# Altium schematic sheet eps_bt.SchDoc: Boost
size A; DrawnBy: J. Reimer T. Yeung M. Au; Organization: UTAT SS; DocumentNumber: 3; Revision: 2.0; SheetNumber: 3; SheetTotal: 17
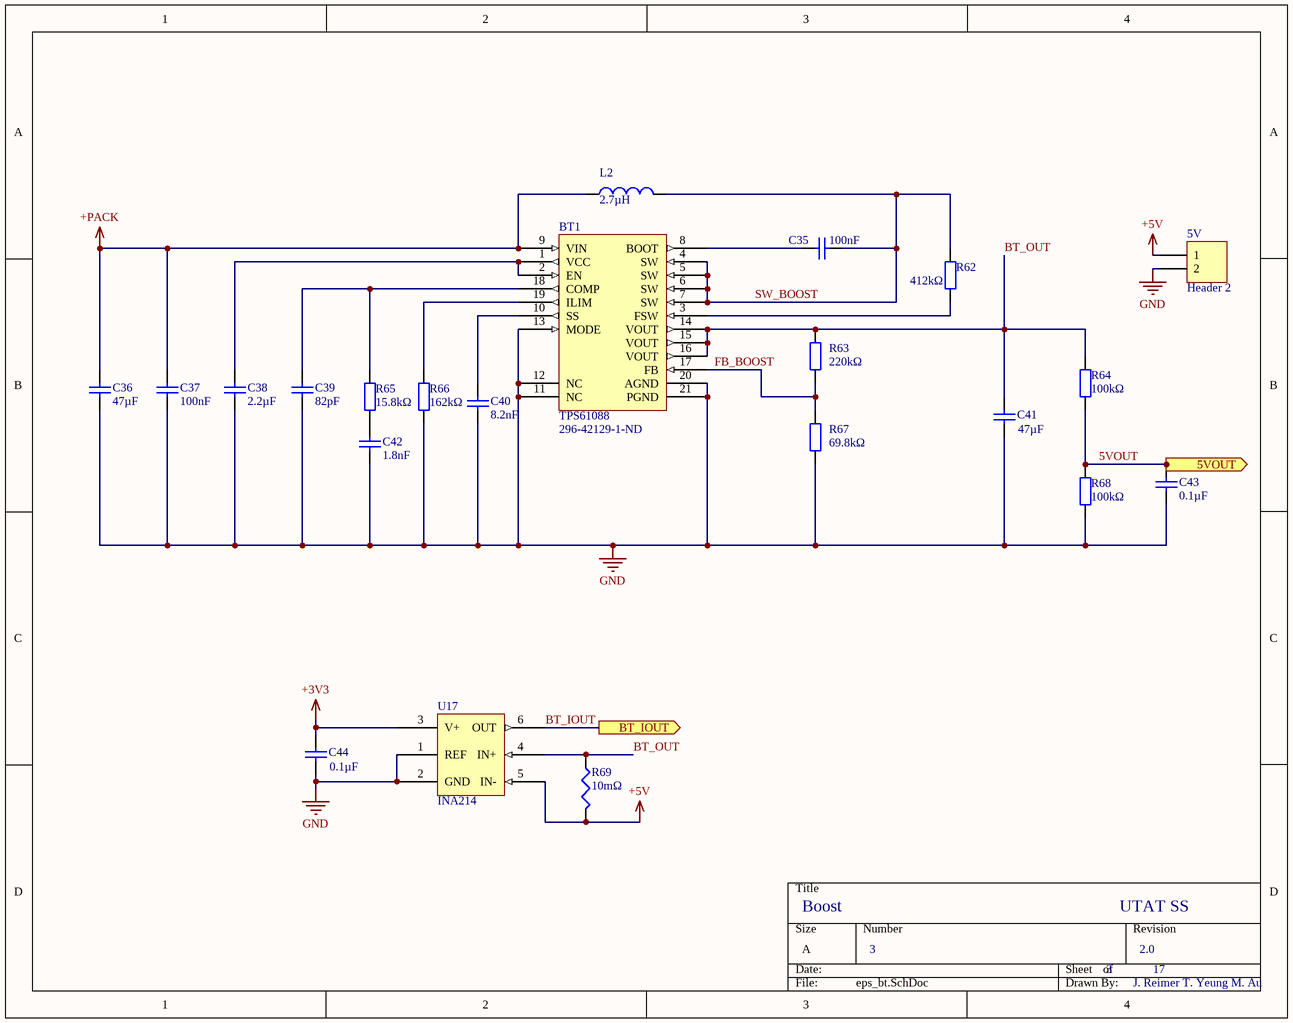
[diagram p0: eps_bt.SchDoc]

## Parts
5V  Header 2  [CON2_SCREW_5.00MM_691102710002]
BT1  TPS61088  Supplier Part Number 1: 296-42129-1-ND  [QFN50P450X350X100-21N]
C35  100nF  [1608[0603]]
C36  47µF  [C0805]
C37  100nF  [C0805]
C38  2.2µF  [1608[0603]]
C39  82pF  [1608[0603]]
C40  8.2nF  [1608[0603]]
C41  47µF  [C0805]
C42  1.8nF  [1608[0603]]
C43  0.1µF  [1608[0603]]
C44  0.1µF  [1608[0603]]
L2  2.7µH  [74439358022]
R62  412kΩ  [1608[0603]]
R63  220kΩ  [1608[0603]]
R64  100kΩ  [1608[0603]]
R65  15.8kΩ  [1608[0603]]
R66  162kΩ  [1608[0603]]
R67  69.8kΩ  [1608[0603]]
R68  100kΩ  [1608[0603]]
R69  10mΩ  [C1206]
U17  INA214  [SOT65P210X110-6N]

## Ports
5VOUT (out), BT_IOUT (out)

## Nets
+3V3: C44.1 U17.3(V+)
+5V: 5V.1 R69.2 U17.5(IN-)
+PACK: BT1.9(VIN) C36.2 C37.2 L2.1
GND: 5V.2 BT1.11(NC) BT1.12(NC) BT1.13(MODE) BT1.20(AGND) BT1.21(PGND) C36.1 C37.1 C38.1 C39.1 C40.1 C41.1 C42.1 C43.2 C44.2 R66.1 R67.1 R68.1 U17.1(REF) U17.2(GND)
5VOUT: C43.1 R64.1 R68.2 ; port 5VOUT
BT_IOUT: U17.6(OUT) ; port BT_IOUT
BT_OUT: BT1.14(VOUT) BT1.15(VOUT) BT1.16(VOUT) C41.2 R63.2 R64.2 R69.1 U17.4(IN+)
FB_BOOST: BT1.17(FB) R63.1 R67.2
SW_BOOST: BT1.4(SW) BT1.5(SW) BT1.6(SW) BT1.7(SW) C35.1 L2.2 R62.1
NetBT1_1: BT1.1(VCC) BT1.2(EN) C38.2
NetBT1_3: BT1.3(FSW) R62.2
NetBT1_8: BT1.8(BOOT) C35.2
NetBT1_10: BT1.10(SS) C40.2
NetBT1_18: BT1.18(COMP) C39.2 R65.2
NetBT1_19: BT1.19(ILIM) R66.2
NetC42_2: C42.2 R65.1

## Library data of the parts
5V = Header 2: Battery Header, 2-Pin; LatestRevisionDate: 17-Jul-2002; LatestRevisionNote: Re-released for DXP Platform.; Publisher: Altium Limited; Supplier 1: Digi-Key; Supplier Part Number 1: WM1351-ND
BT1 = TPS61088: Boost converter; Supplier 1: Digi-Key
C35 = Cap: Capacitor, Cbst; Published: 8-Jun-2000; LatestRevisionDate: 17-Jul-2002; LatestRevisionNote: Re-released for DXP Platform.; PackageReference: RAD-0.3; Publisher: Altium Limited; PackageDescription: Radial Cap, Thru-Hole; 2 Leads; 0.3 in Pin Spacing; Value: 100nF; Supplier 1: Digi-Key; Supplier Part Number 1: 311-1344-6-ND
C36 = Cap: Capacitor, Cinbt1; Published: 8-Jun-2000; LatestRevisionDate: 17-Jul-2002; LatestRevisionNote: Re-released for DXP Platform.; PackageReference: RAD-0.3; Publisher: Altium Limited; PackageDescription: Radial Cap, Thru-Hole; 2 Leads; 0.3 in Pin Spacing; Value: 47µF; Supplier 1: Digi-Key; Supplier Part Number 1: 490-9960-6-ND
C37 = Cap: Capacitor, Cinbt2; Published: 8-Jun-2000; LatestRevisionDate: 17-Jul-2002; LatestRevisionNote: Re-released for DXP Platform.; PackageReference: RAD-0.3; Publisher: Altium Limited; PackageDescription: Radial Cap, Thru-Hole; 2 Leads; 0.3 in Pin Spacing; Value: 100nF; Supplier 1: Digi-Key; Supplier Part Number 1: 311-1141-6-ND
C38 = Cap: Capacitor, Cvcc1; Published: 8-Jun-2000; LatestRevisionDate: 17-Jul-2002; LatestRevisionNote: Re-released for DXP Platform.; PackageReference: RAD-0.3; Publisher: Altium Limited; PackageDescription: Radial Cap, Thru-Hole; 2 Leads; 0.3 in Pin Spacing; Value: 2.2µF; Supplier 1: Digi-Key; Supplier Part Number 1: 399-7886-6-ND
C39 = Cap: Capacitor, Ccomp1; Published: 8-Jun-2000; LatestRevisionDate: 17-Jul-2002; LatestRevisionNote: Re-released for DXP Platform.; PackageReference: RAD-0.3; Publisher: Altium Limited; PackageDescription: Radial Cap, Thru-Hole; 2 Leads; 0.3 in Pin Spacing; Value: 82pF; Supplier 1: Digi-Key; Supplier Part Number 1: 311-1068-6-ND
C40 = Cap: Capacitor, Css1; Published: 8-Jun-2000; LatestRevisionDate: 17-Jul-2002; LatestRevisionNote: Re-released for DXP Platform.; PackageReference: RAD-0.3; Publisher: Altium Limited; PackageDescription: Radial Cap, Thru-Hole; 2 Leads; 0.3 in Pin Spacing; Value: 8.2nF; Supplier 1: Digi-Key; Supplier Part Number 1: 478-1226-1-ND
C41 = Cap: Capacitor, Cout; Published: 8-Jun-2000; LatestRevisionDate: 17-Jul-2002; LatestRevisionNote: Re-released for DXP Platform.; PackageReference: RAD-0.3; Publisher: Altium Limited; PackageDescription: Radial Cap, Thru-Hole; 2 Leads; 0.3 in Pin Spacing; Value: 47µF; Supplier 1: Digi-Key; Supplier Part Number 1: 490-9960-6-ND
C42 = Cap: Capacitor, Ccomp2; Published: 8-Jun-2000; LatestRevisionDate: 17-Jul-2002; LatestRevisionNote: Re-released for DXP Platform.; PackageReference: RAD-0.3; Publisher: Altium Limited; PackageDescription: Radial Cap, Thru-Hole; 2 Leads; 0.3 in Pin Spacing; Value: 1.8nF; Supplier 1: Digi-Key; Supplier Part Number 1: 311-3373-6-ND
C43 = Cap: Capacitor; Published: 8-Jun-2000; LatestRevisionDate: 17-Jul-2002; LatestRevisionNote: Re-released for DXP Platform.; PackageReference: RAD-0.3; Publisher: Altium Limited; PackageDescription: Radial Cap, Thru-Hole; 2 Leads; 0.3 in Pin Spacing; Value: 0.1µF
C44 = Cap Semi: Capacitor (Semiconductor SIM Model); Published: 8-Jun-2000; LatestRevisionDate: 29-May-2009; LatestRevisionNote: IPC-7351 Footprint Added.; PackageReference: C1206; Publisher: Altium Limited; PackageDescription: Chip Capacitor; Value: 0.1µF
L2 = Inductor: Inductor, Lbt; Code_IEC: 1005; Published: 8-Jun-2000; LatestRevisionDate: 29-May-2009; LatestRevisionNote: IPC-7351 Footprint Added.; PackageReference: 0402-A; Publisher: Altium Limited; PackageDescription: Chip Inductor; Code_JEITA: 0402; Value: 2.7µH; Supplier 1: Digi-Key; Supplier Part Number 1: 732-7274-6-ND
R62 = Res2: Resistor, Rt; Published: 8-Jun-2000; LatestRevisionDate: 17-Jul-2002; LatestRevisionNote: Re-released for DXP Platform.; PackageReference: AXIAL-0.4; Publisher: Altium Limited; PackageDescription: Axial Device, Thru-Hole; 2 Leads; 0.4 in Pin Spacing; Value: 412kΩ; Supplier 1: Digi-Key; Supplier Part Number 1: P412KHDKR-ND
R63 = Res2: Resistor, Rfbt_bt1; Published: 8-Jun-2000; LatestRevisionDate: 17-Jul-2002; LatestRevisionNote: Re-released for DXP Platform.; PackageReference: AXIAL-0.4; Publisher: Altium Limited; PackageDescription: Axial Device, Thru-Hole; 2 Leads; 0.4 in Pin Spacing; Value: 220kΩ; Supplier 1: Digi-Key; Supplier Part Number 1: P220KHDKR-ND
R64 R68 = Res2: Resistor; Published: 8-Jun-2000; LatestRevisionDate: 17-Jul-2002; LatestRevisionNote: Re-released for DXP Platform.; PackageReference: AXIAL-0.4; Publisher: Altium Limited; PackageDescription: Axial Device, Thru-Hole; 2 Leads; 0.4 in Pin Spacing; Value: 100kΩ
  R64: Supplier 1: Digi-Key; Supplier Part Number 1: 541-100KHDKR-ND
R65 = Res2: Resistor, Rcomp1; Published: 8-Jun-2000; LatestRevisionDate: 17-Jul-2002; LatestRevisionNote: Re-released for DXP Platform.; PackageReference: AXIAL-0.4; Publisher: Altium Limited; PackageDescription: Axial Device, Thru-Hole; 2 Leads; 0.4 in Pin Spacing; Value: 15.8kΩ; Supplier 1: Digi-Key; Supplier Part Number 1: P15.8KHDKR-ND
R66 = Res2: Resistor, Rlim1; Published: 8-Jun-2000; LatestRevisionDate: 17-Jul-2002; LatestRevisionNote: Re-released for DXP Platform.; PackageReference: AXIAL-0.4; Publisher: Altium Limited; PackageDescription: Axial Device, Thru-Hole; 2 Leads; 0.4 in Pin Spacing; Value: 162kΩ; Supplier 1: Digi-Key; Supplier Part Number 1: P162KHDKR-ND
R67 = Res2: Resistor, Rfbb_bt1; Published: 8-Jun-2000; LatestRevisionDate: 17-Jul-2002; LatestRevisionNote: Re-released for DXP Platform.; PackageReference: AXIAL-0.4; Publisher: Altium Limited; PackageDescription: Axial Device, Thru-Hole; 2 Leads; 0.4 in Pin Spacing; Value: 69.8kΩ; Supplier 1: Digi-Key; Supplier Part Number 1: P69.8KHDKR-ND
R69 = Res3: Resistor; Published: 8-Jun-2000; LatestRevisionDate: 29-May-2009; LatestRevisionNote: IPC-7351 Footprint Added.; PackageReference: J1-0603; Publisher: Altium Limited; PackageDescription: Chip Resistor; Value: 10mΩ
U17 = INA214: Current monitor